# Altium schematic sheet 05_ESP32.SchDoc
size 420 x 297 mm; SheetNumber: 5; SheetTotal: 6
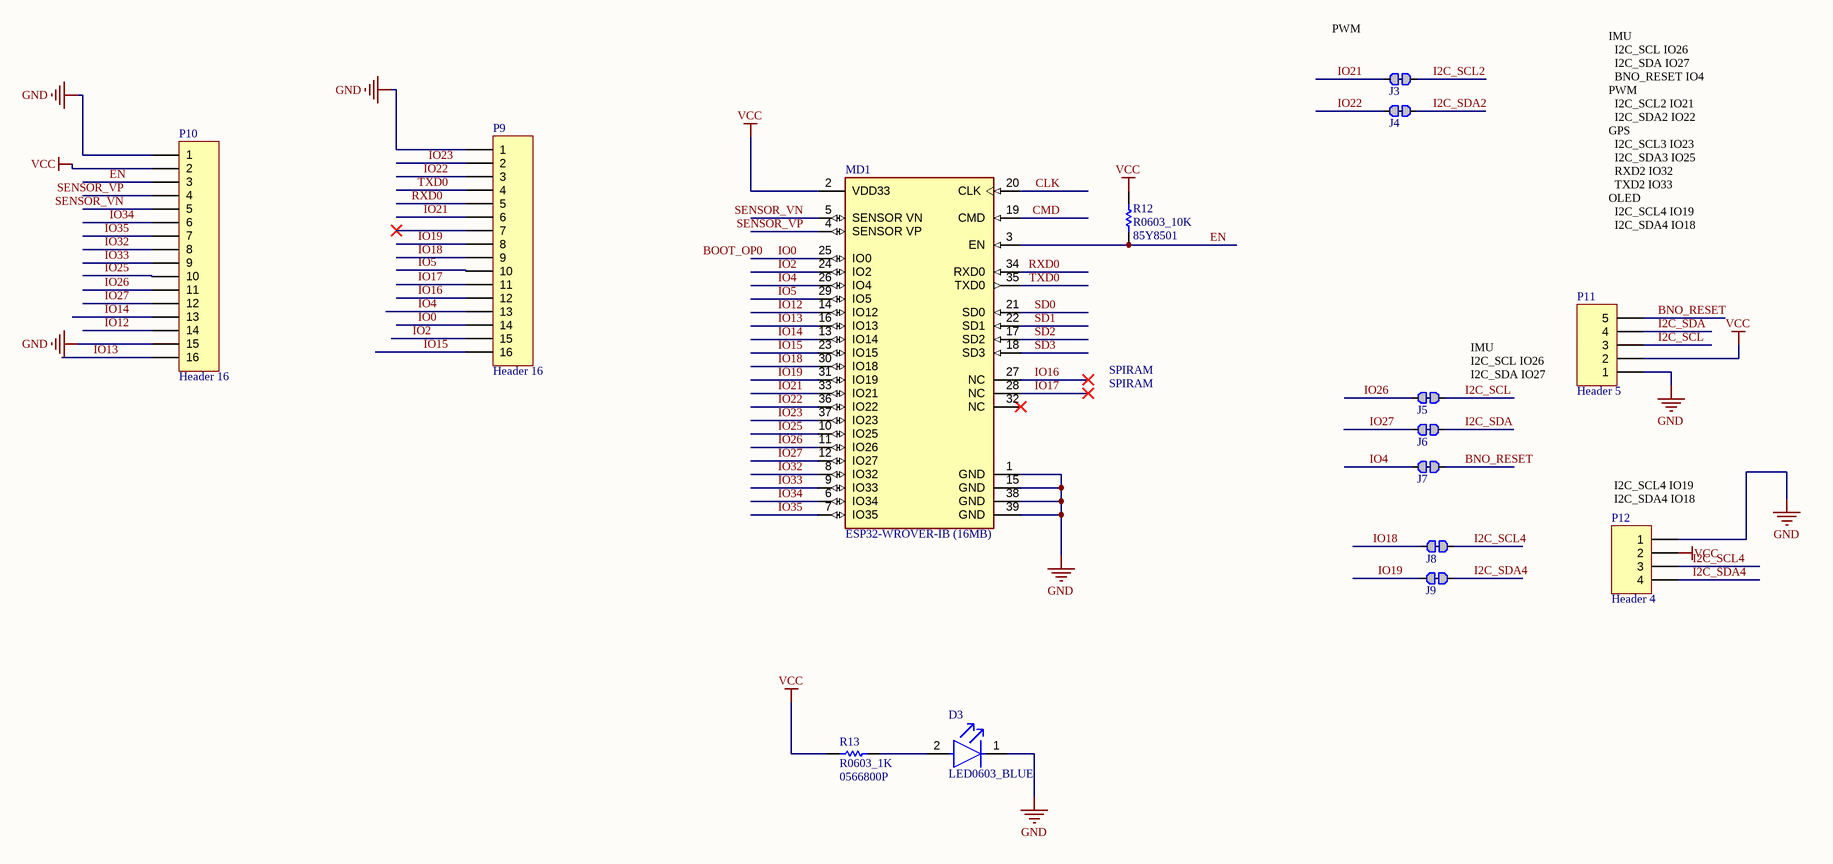
[diagram p0: 05_ESP32.SchDoc]

## Parts
D3  LED0603_BLUE  [FP-LTST-C191TBKT-MFG]
J3  Jumper  [0402-0R]  (value not drawn)
J4  Jumper  [0402-0R]  (value not drawn)
J5  Jumper  [0402-0R]  (value not drawn)
J6  Jumper  [0402-0R]  (value not drawn)
J7  Jumper  [0402-0R]  (value not drawn)
J8  Jumper  [0402-0R]  (value not drawn)
J9  Jumper  [0402-0R]  (value not drawn)
MD1  ESP32-WROVER-IB (16MB)  [FP-ESP32-WROVER-MFG]
P9  Header 16  [HDR1X16]
P10  Header 16  [HDR1X16]
P11  Header 5  [HDR1X5]
P12  Header 4  [HDR1X4]
R12  R0603_10K  Supplier Part Number 1: 85Y8501  [RESC1609X55X30LL15T15]
R13  R0603_1K  Supplier Part Number 1: 0566800P  [RESC1609X55X30LL15T15]

## Nets
GND: D3.1(C) MD1.1(GND) MD1.15(GND) MD1.38(GND) MD1.39(GND) P9.1 P10.1 P10.15 P11.1 P12.1
VCC: MD1.2(VDD33) P10.2 P11.2 P12.2 R12.2 R13.2
BNO_RESET: J7.2 P11.5
BOOT_OP0: MD1.25(IO0) P9.14  [also labelled IO0]
CLK: MD1.20(CLK)
CMD: MD1.19(CMD)
EN: MD1.3(EN) P10.3 R12.1
I2C_SCL: J5.2 P11.3
I2C_SCL2: J3.2
I2C_SCL4: J8.2 P12.3
I2C_SDA: J6.2 P11.4
I2C_SDA2: J4.2
I2C_SDA4: J9.2 P12.4
IO2: MD1.24(IO2) P9.15
IO4: J7.1 MD1.26(IO4) P9.13
IO5: MD1.29(IO5) P9.10
IO12: MD1.14(IO12) P10.14
IO13: MD1.16(IO13) P10.16
IO14: MD1.13(IO14) P10.13
IO15: MD1.23(IO15) P9.16
IO16: MD1.27(NC) P9.12
IO17: MD1.28(NC) P9.11
IO18: J8.1 MD1.30(IO18) P9.9
IO19: J9.1 MD1.31(IO19) P9.8
IO21: J3.1 MD1.33(IO21) P9.6
IO22: J4.1 MD1.36(IO22) P9.3
IO23: MD1.37(IO23) P9.2
IO25: MD1.10(IO25) P10.10
IO26: J5.1 MD1.11(IO26) P10.11
IO27: J6.1 MD1.12(IO27) P10.12
IO32: MD1.8(IO32) P10.8
IO33: MD1.9(IO33) P10.9
IO34: MD1.6(IO34) P10.6
IO35: MD1.7(IO35) P10.7
RXD0: MD1.34(RXD0) P9.5
SD0: MD1.21(SD0)
SD1: MD1.22(SD1)
SD2: MD1.17(SD2)
SD3: MD1.18(SD3)
SENSOR_VN: MD1.5(SENSOR_VN) P10.5
SENSOR_VP: MD1.4(SENSOR_VP) P10.4
TXD0: MD1.35(TXD0) P9.4
NetD3_2: D3.2(A) R13.1

Not connected (* = marked no-connect by the designer): MD1 32(NC)*; P9 7*

## Notes on the sheet
- (near J3) PWM
- IMU
  I2C_SCL IO26
  I2C_SDA IO27
  BNO_RESET IO4
  PWM
  I2C_SCL2 IO21
  I2C_SDA2 IO22
  GPS
  I2C_SCL3 IO23
  I2C_SDA3 IO25
  RXD2 IO32
  TXD2 IO33
  OLED
  I2C_SCL4 IO19
  I2C_SDA4 IO18
- SPIRAM
- IMU
  I2C_SCL IO26
  I2C_SDA IO27
- (near P12) I2C_SCL4 IO19
  I2C_SDA4 IO18

## Library data of the parts
D3 = CMP-22017-000008-1: LED BLUE CLEAR CHIP SMD; Lens Color: Colorless; Dominant Wavelength: 475nm; Forward Current: 20mA; Wavelength: 468nm; Viewing Angle: 130°; Power Dissipation: 76mW; Luminous Intensity: 180mcd; Reverse Voltage: 5V; Number of Elements: 1; Lens Style: Diffused; Forward Voltage: 3.8V; Max Power Dissipation: 75mW; Case Code (Metric): 1608; Packaging: Tape and Reel; Case/Package: 0603; Depth: 1.6mm; Mount: Surface Mount; Lead Free: Lead Free; Min Operating Temperature: -20°C; Lens Transparency: Clear; Illumination Color: Blue; Height: 0.55mm; Test Current: 20mA; Case Code (Imperial): 0603; Max Operating Temperature: 80°C; Number of Pins: 2; Length: 0.8mm; Radiation Hardening: No; Package Quantity: 1; Number of LEDs: 1; Width: 0.8mm; Color: Blue
J3-J9 = Jumper: Resistor
MD1 = CMP-194065-000005-1: SMD MODULE, ESP32-D0WDQ6; Manufacturer: Espressif Systems; Interface: I2C,SPI,UART,I2S,Other; Number Of Adc Channels: 16; Data Rate: 150Mbits/s; Number Of Gpio: 20; Sensitivity: -98dBm; Max Frequency: 2.5GHz; Bandwidth: 0.1GHz; Max Supply Voltage: 3.6V; Min Supply Voltage: 2.3V; Nominal Supply Current: 80mA; Height: 3.4mm; Device Class L3: Transceivers; Octopart: https://octopart.com/esp32-wrover-espressif+systems-89171348; Device Class L2: RF Semiconductors and Devices; ComponentLink2Description: Datasheet; RoHS: TRUE; Lead Free: Yes; Device Class L1: Integrated Circuits (ICs); Temperature Range High: +85°C; Digikey Description: SMD MODULE, ESP32-D0WDQ6, 32MBIT; Package: ESP32-WROVER; Mouser Description: Bluetooth and Wi-Fi Module 2.4GHz to 2.5GHz 2.3V to 3.6V 38-Pin SMD Module; Temperature: -40°C to +85°C; Category: UNK; Manufacturer Part Number: ESP32-WROVER; Automotive: No; Temperature Range Low: -40°C; ComponentLink2URL: https://forum.upverter.com/uploads/default/original/3X/1/9/19ab4f33dd815ce1b2b0bb210f0ab7d5aab1dea3.pdf
P9 P10 = Header 16: Header, 16-Pin; LatestRevisionDate: 17-Jul-2002; LatestRevisionNote: Re-released for DXP Platform.; Publisher: Altium Limited
P11 = Header 5: Header, 5-Pin; LatestRevisionDate: 17-Jul-2002; LatestRevisionNote: Re-released for DXP Platform.; Publisher: Altium Limited
P12 = Header 4: Header, 4-Pin; LatestRevisionDate: 17-Jul-2002; LatestRevisionNote: Re-released for DXP Platform.; Publisher: Altium Limited
R12 = R0603: PANASONIC - ERJ-3EKF1002V. - THICK FILM CHIP RES, 0603, 1%, PRECISION; Resistance: 10kR; Power Rating: 100mW; Temperature Coefficient: 100ppm/°C; Voltage Rating: 75V; Supplier 1: Newark; Manufacturer: Panasonic; Manufacturer Part Number: ERJ-3EKF1002V; RoHS: Yes; Category: Chip SMD Resistors; Stock 1: 27295001; Pricing 1: 5000=0.00900, 10000=0.00900 (USD); Mount: Surface Mount; Case/Package: 0603; Number of Pins: 2; Case Code (Metric): 1608; Case Code (Imperial): 0603; Contact Plating: Tin; Size Code: 0603; Min Operating Temperature: -55°C; Max Operating Temperature: 155°C; Packaging: Tape and Reel; Resistor Type: Thick Film; Number of Terminations: 2; Max Power Dissipation: 100mW; Tolerance: 1%; Series: ERJ; Construction: Rectangular; Features: Automotive AEC-Q200; Package Quantity: 1; Voltage Rating (DC): 75V; Termination: SMD/SMT; Resistance Tolerance: 1%; Technology: THICK FILM; Length: 1.6mm; Width: 0.031inch; Height: 0.45mm; Depth: 0.8mm; Radiation Hardening: No; Military Standard: Not; Lead Free: Lead Free; RoHS Compliant: Yes; REACH SVHC: No SVHC; ComponentLink1URL: https://datasheet.ciiva.com/48530/aoa0000ce2-48530988.pdf?src-supplier=Avnet; ComponentLink1Description: https://datasheet.ciiva.com/48530/aoa0000ce2-48530988.pdf?src-supplier=Avnet; ComponentLink2URL: https://datasheet.ciiva.com/24070/aoa0000ce2-24070318.pdf?src-supplier=Mouser; ComponentLink2Description: https://datasheet.ciiva.com/24070/aoa0000ce2-24070318.pdf?src-supplier=Mouser; ComponentLink3URL: https://datasheet.ciiva.com/9194/aoa0000ce2-9194199.pdf?src-supplier=Avnet; ComponentLink3Description: https://datasheet.ciiva.com/9194/aoa0000ce2-9194199.pdf?src-supplier=Avnet; ComponentLink4URL: https://datasheet.ciiva.com/30208/aoa0000ce2-30208985.pdf?src-supplier=Onlinecomponents.com; ComponentLink4Description: https://datasheet.ciiva.com/30208/aoa0000ce2-30208985.pdf?src-supplier=Onlinecomponents.com; ComponentLink5URL: https://datasheet.ciiva.com/16759/70260748-16759807.pdf?src-supplier=Allied+Electronics; ComponentLink5Description: https://datasheet.ciiva.com/16759/70260748-16759807.pdf?src-supplier=Allied+Electronics; ComponentLink6URL: https://datasheet.ciiva.com/7830/aoa0000ce2-7830729.pdf?src-supplier=Element14; ComponentLink6Description: https://datasheet.ciiva.com/7830/aoa0000ce2-7830729.pdf?src-supplier=Element14; ComponentLink7URL: https://datasheet.ciiva.com/28514/426256-28514198.pdf?src-supplier=Element14; ComponentLink7Description: https://datasheet.ciiva.com/28514/426256-28514198.pdf?src-supplier=Element14; ComponentLink8URL: https://datasheet.ciiva.com/46372/1678782-46372725.pdf?src-supplier=Element14; ComponentLink8Description: https://datasheet.ciiva.com/46372/1678782-46372725.pdf?src-supplier=Element14; ComponentLink9URL: https://datasheet.ciiva.com/16511/aoa0000ce2-16511861.pdf?src-supplier=Avnet+Asia; ComponentLink9Description: https://datasheet.ciiva.com/16511/aoa0000ce2-16511861.pdf?src-supplier=Avnet+Asia; ComponentLink10URL: https://datasheet.ciiva.com/17212/aoa0000ce2-17212105.pdf?src-supplier=Avnet+Europe; ComponentLink10Description: https://datasheet.ciiva.com/17212/aoa0000ce2-17212105.pdf?src-supplier=Avnet+Europe
R13 = R0603: Res Thin Film 0603 1K Ohm 0.1% 1/10W ±25ppm/°C Molded SMD SMD Punched Carrier T/R; Manufacturer: Panasonic; Manufacturer Part Number: ERA-3AEB102V; Resistance: 1kR; Power Rating: 100mW; Voltage Rating: 75V; Supplier 1: RSComponents; RoHS: Yes; Category: Chip SMD Resistors; Stock 1: 1; Pricing 1: 5=0.38700, 50=0.32600, 250=0.12700, 1250=0.06600, 2500=0.04700 (USD); Mount: Surface Mount; Case/Package: 0603; Number of Pins: 2; Case Code (Imperial): 0603; Case Code (Metric): 1608; Contact Plating: Tin; Size Code: 0603; Min Operating Temperature: -55°C; Max Operating Temperature: 155°C; Packaging: Tape and Reel; Resistor Type: Thin Film; Temperature Coefficient: 25ppm/°C; Series: ERA-3A; Construction: Rectangular; Tolerance: 0.1%; Number of Terminations: 2; Max Power Dissipation: 100mW; Termination: SMD/SMT; Package Quantity: 5000; Resistance Tolerance: 0.1%; Technology: METAL FILM; Length: 1.6mm; Width: 0.8mm; Height: 0.45mm; Depth: 0.8mm; Radiation Hardening: No; Military Standard: Not; RoHS Compliant: Yes; REACH SVHC: No SVHC; ComponentLink1URL: https://datasheet.ciiva.com/11808/0900766b80fe20f7-11808019.pdf?src-supplier=RSComponents; ComponentLink1Description: https://datasheet.ciiva.com/11808/0900766b80fe20f7-11808019.pdf?src-supplier=RSComponents; ComponentLink2URL: https://datasheet.ciiva.com/29183/450752-da-01-en-widerstand-0603-era-29183754.pdf?src-supplier=Conrad; ComponentLink2Description: https://datasheet.ciiva.com/29183/450752-da-01-en-widerstand-0603-era-29183754.pdf?src-supplier=Conrad; ComponentLink3URL: https://datasheet.ciiva.com/5734/aoa0000ce26-5734524.pdf?src-supplier=Farnell; ComponentLink3Description: https://datasheet.ciiva.com/5734/aoa0000ce26-5734524.pdf?src-supplier=Farnell; ComponentLink4URL: https://datasheet.ciiva.com/5734/485442-5734525.pdf?src-supplier=Farnell; ComponentLink4Description: https://datasheet.ciiva.com/5734/485442-5734525.pdf?src-supplier=Farnell; ComponentLink5URL: https://datasheet.ciiva.com/9198/aoa0000ce26-9198972.pdf?src-supplier=Avnet; ComponentLink5Description: https://datasheet.ciiva.com/9198/aoa0000ce26-9198972.pdf?src-supplier=Avnet; ComponentLink6URL: https://datasheet.ciiva.com/48530/era-eng-tds-48530582.pdf?src-supplier=Distrelec; ComponentLink6Description: https://datasheet.ciiva.com/48530/era-eng-tds-48530582.pdf?src-supplier=Distrelec; ComponentLink7URL: https://datasheet.ciiva.com/24071/aoa0000ce26-197354-24071510.pdf?src-supplier=Mouser; ComponentLink7Description: https://datasheet.ciiva.com/24071/aoa0000ce26-197354-24071510.pdf?src-supplier=Mouser; ComponentLink8URL: https://datasheet.ciiva.com/16853/aoa0000ce26-16853231.pdf?src-supplier=Avnet+Europe; ComponentLink8Description: https://datasheet.ciiva.com/16853/aoa0000ce26-16853231.pdf?src-supplier=Avnet+Europe; ComponentLink9URL: https://datasheet.ciiva.com/16426/aoa0000ce26-16426809.pdf?src-supplier=Future+Electronics; ComponentLink9Description: https://datasheet.ciiva.com/16426/aoa0000ce26-16426809.pdf?src-supplier=Future+Electronics; ComponentLink10URL: https://datasheet.ciiva.com/46393/1776116-46393695.pdf?src-supplier=Element14; ComponentLink10Description: https://datasheet.ciiva.com/46393/1776116-46393695.pdf?src-supplier=Element14; ComponentLink11URL: https://datasheet.ciiva.com/46422/1776116-46422455.pdf?src-supplier=Element14; ComponentLink11Description: https://datasheet.ciiva.com/46422/1776116-46422455.pdf?src-supplier=Element14; ComponentLink12URL: https://datasheet.ciiva.com/46422/485442-46422519.pdf?src-supplier=Element14; ComponentLink12Description: https://datasheet.ciiva.com/46422/485442-46422519.pdf?src-supplier=Element14; ComponentLink13URL: https://datasheet.ciiva.com/28531/485442-28531944.pdf?src-supplier=Element14; ComponentLink13Description: https://datasheet.ciiva.com/28531/485442-28531944.pdf?src-supplier=Element14; ComponentLink14URL: https://datasheet.ciiva.com/16781/70068849-16781703.pdf?src-supplier=Allied+Electronics; ComponentLink14Description: https://datasheet.ciiva.com/16781/70068849-16781703.pdf?src-supplier=Allied+Electronics; ComponentLink15URL: https://datasheet.ciiva.com/16725/70068849-16725038.pdf?src-supplier=Allied+Electronics; ComponentLink15Description: https://datasheet.ciiva.com/16725/70068849-16725038.pdf?src-supplier=Allied+Electronics